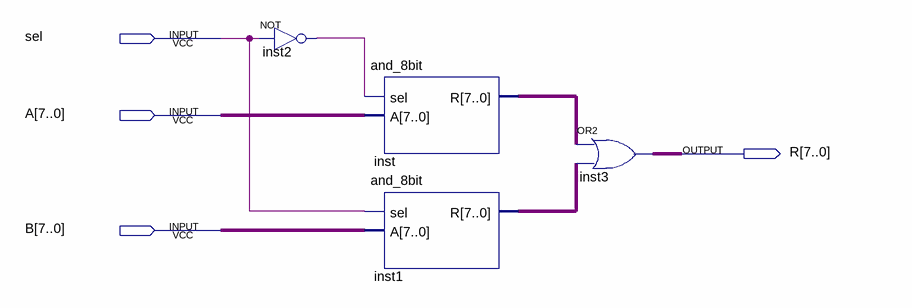
[diagram p0: schematic sheet]
// Quartus schematic sel2to1_8bit.bdf as structural Verilog: 4 symbols, 4 pins
module sel2to1_8bit (
  input  sel,
  input  [7:0] A,
  input  [7:0] B,
  output [7:0] R
);

  wire inst2_out;
  wire [7:0] inst1_r, inst_r;

  not inst2 (inst2_out, sel);
  and_8bit inst (.sel(inst2_out), .A(A), .R(inst_r));
  and_8bit inst1 (.sel(sel), .A(B), .R(inst1_r));
  assign R = inst_r | inst1_r;  // OR2 inst3, 8 bits wide
endmodule
